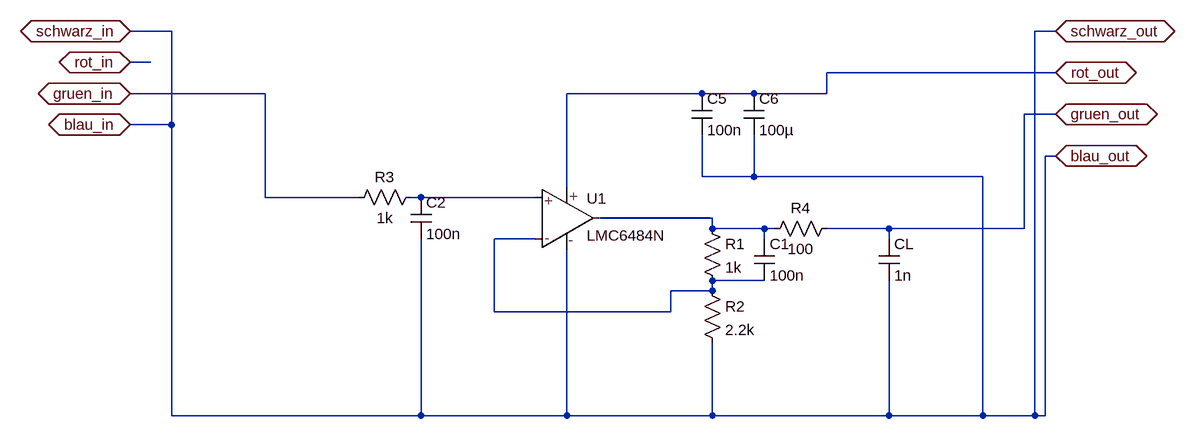
[diagram p0: schematic LevelshifterAlt.asc]
LevelshifterAlt.asc, the LTspice schematic file:
Version 4
SHEET 1 1276 680
WIRE -432 -128 -496 -128
WIRE 928 -128 896 -128
WIRE -464 -80 -496 -80
WIRE 928 -64 576 -64
WIRE -288 -32 -496 -32
WIRE 384 -32 176 -32
WIRE 464 -32 384 -32
WIRE 576 -32 576 -64
WIRE 576 -32 464 -32
WIRE 928 0 880 0
WIRE -432 16 -432 -128
WIRE -432 16 -496 16
WIRE 928 64 912 64
WIRE 384 96 384 32
WIRE 464 96 464 32
WIRE 464 96 384 96
WIRE 816 96 464 96
WIRE 176 112 176 -32
WIRE -288 128 -288 -32
WIRE -144 128 -288 128
WIRE -48 128 -64 128
WIRE 128 128 -48 128
WIRE 400 160 224 160
WIRE 400 176 400 160
WIRE 480 176 400 176
WIRE 496 176 480 176
WIRE 672 176 576 176
WIRE 880 176 880 0
WIRE 880 176 672 176
WIRE 128 192 64 192
WIRE 480 192 480 176
WIRE 672 192 672 176
WIRE 480 256 400 256
WIRE 400 272 400 256
WIRE 400 272 336 272
WIRE 64 304 64 192
WIRE 336 304 336 272
WIRE 336 304 64 304
WIRE -432 464 -432 16
WIRE -48 464 -48 192
WIRE -48 464 -432 464
WIRE 176 464 176 208
WIRE 176 464 -48 464
WIRE 400 464 400 352
WIRE 400 464 176 464
WIRE 672 464 672 256
WIRE 672 464 400 464
WIRE 816 464 816 96
WIRE 816 464 672 464
WIRE 896 464 896 -128
WIRE 896 464 816 464
WIRE 912 464 912 64
WIRE 912 464 896 464
FLAG -496 -128 schwarz_in
IOPIN -496 -128 BiDir
FLAG -496 -80 rot_in
IOPIN -496 -80 BiDir
FLAG -496 -32 gruen_in
IOPIN -496 -32 BiDir
FLAG -496 16 blau_in
IOPIN -496 16 BiDir
FLAG 928 -128 schwarz_out
IOPIN 928 -128 BiDir
FLAG 928 0 gruen_out
IOPIN 928 0 BiDir
FLAG 928 64 blau_out
IOPIN 928 64 BiDir
FLAG 928 -64 rot_out
IOPIN 928 -64 BiDir
SYMBOL res 384 160 R0
SYMATTR InstName R1
SYMATTR Value 1k
SYMBOL res 384 256 R0
SYMATTR InstName R2
SYMATTR Value 2.2k
SYMBOL res -48 112 R90
WINDOW 0 0 56 VBottom 2
WINDOW 3 32 56 VTop 2
SYMATTR InstName R3
SYMATTR Value 1k
SYMBOL res 592 160 R90
WINDOW 0 0 56 VBottom 2
WINDOW 3 32 56 VTop 2
SYMATTR InstName R4
SYMATTR Value 100
SYMBOL cap -64 128 R0
SYMATTR InstName C2
SYMATTR Value 100n
SYMBOL cap 368 -32 R0
SYMATTR InstName C5
SYMATTR Value 100n
SYMBOL cap 448 -32 R0
SYMATTR InstName C6
SYMATTR Value 100µ
SYMBOL cap 464 192 R0
SYMATTR InstName C1
SYMATTR Value 100n
SYMBOL cap 656 192 R0
SYMATTR InstName CL
SYMATTR Value 1n
SYMBOL LMC6484N 160 160 R0
SYMATTR InstName U1

The netlist it stands for:
* LevelshifterAlt.asc
R1 N002 N003 1k
R2 N003 blau_out 2.2k
R3 N001 gruen_in 1k
R4 gruen_out N002 100
C2 N001 blau_out 100n
C5 rot_out blau_out 100n
C6 rot_out blau_out 100µ
C1 N002 N003 100n
CL gruen_out blau_out 1n
XU1 N001 N003 rot_out blau_out N002 LMC6484N/NS  ; pins +in -in V+ V- out
.lib LMC6484N.txt
.backanno
.end